# EAGLE design BeerTape_Hardware (EAGLE 9.6.2)
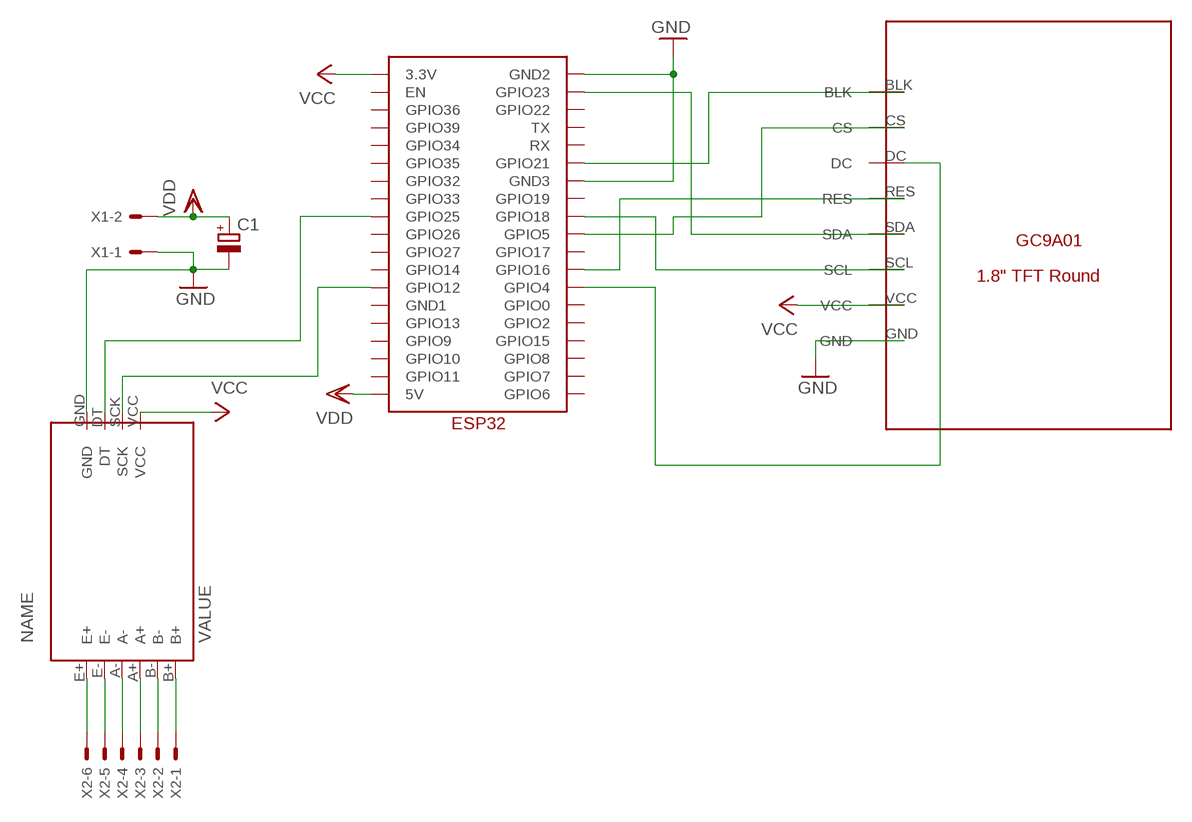
[diagram p0: schematic, sheet 1]

## Parts
C1  CPOL-EUE2,5-6E  [E2,5-6E]
HX711  HX711  HX711A  [HX711]
U$1  GC9A01  [GC9A01]
U$2  ESP32  [ESP32]
X1  KK-156-2  [KK-156-2]
X2  22-23-2061  [22-23-2061]

## Nets
GND [PWR]: C1.- HX711.GND U$1.GND U$2.GND2 U$2.GND3 X1.1
N$1: U$1.DC U$2.GPIO4
N$2: U$1.SDA U$2.GPIO23
N$3: U$1.BLK U$2.GPIO21
N$4: U$1.SCL U$2.GPIO18
N$5: U$1.RES U$2.GPIO16
N$6: U$1.CS U$2.GPIO5
N$7: HX711.SCK U$2.GPIO12
N$8: HX711.DT U$2.GPIO25
N$15: HX711.E+ X2.6
N$16: HX711.E- X2.5
N$17: HX711.A- X2.4
N$18: HX711.A+ X2.3
N$19: HX711.B- X2.2
N$20: HX711.B+ X2.1
VCC [PWR]: HX711.VCC U$1.VCC U$2.3.3V
VDD [PWR]: C1.+ U$2.5V X1.2
Unconnected: U$2.EN U$2.GND1 U$2.GPIO0 U$2.GPIO2 U$2.GPIO6 U$2.GPIO7 U$2.GPIO8 U$2.GPIO9 U$2.GPIO10 U$2.GPIO11 U$2.GPIO13 U$2.GPIO14 U$2.GPIO15 U$2.GPIO17 U$2.GPIO19 U$2.GPIO22 U$2.GPIO26 U$2.GPIO27 U$2.GPIO32 U$2.GPIO33 U$2.GPIO34 U$2.GPIO35 U$2.GPIO36 U$2.GPIO39 U$2.RX U$2.TX

## Library data of the parts
C1 = rcl:CPOL-EU: POLARIZED CAPACITOR, European symbol; SPICEPREFIX: C
HX711 = HX711:HX711
U$1 = GC9A01:GC9A01
U$2 = ESP32:ESP32
X1 = con-molex:KK-156-2: KK 156 HEADER Source: http://www.molex.com/pdm_docs/sd/026604100_sd.pdf; MF: MOLEX; OC_FARNELL: unknown; OC_NEWARK: unknown
X2 = con-molex:22-23-2061: .100" (2.54mm) Center Header - 6 Pin; MF: MOLEX; MPN: 22-23-2061; OC_FARNELL: 1462922; OC_NEWARK: 27C1933

## Net classes
0 default: width 0.508 mm, clearance 0.381 mm
1 PWR: width 0.635 mm, clearance 0.381 mm

## Board
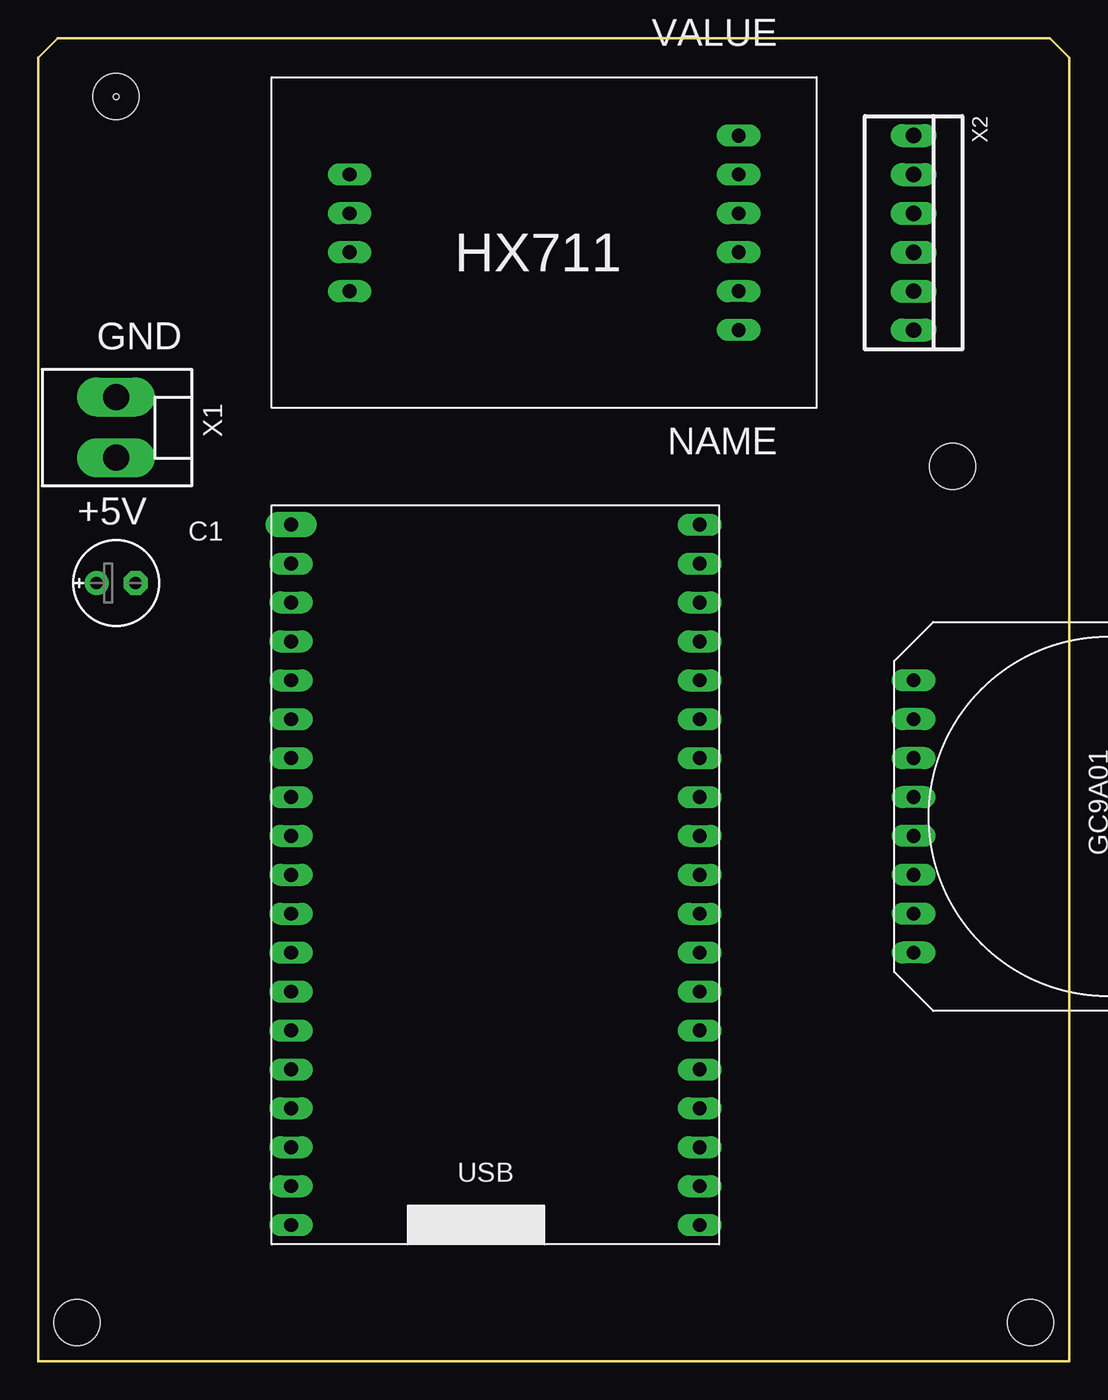
[diagram p1: board, top side]
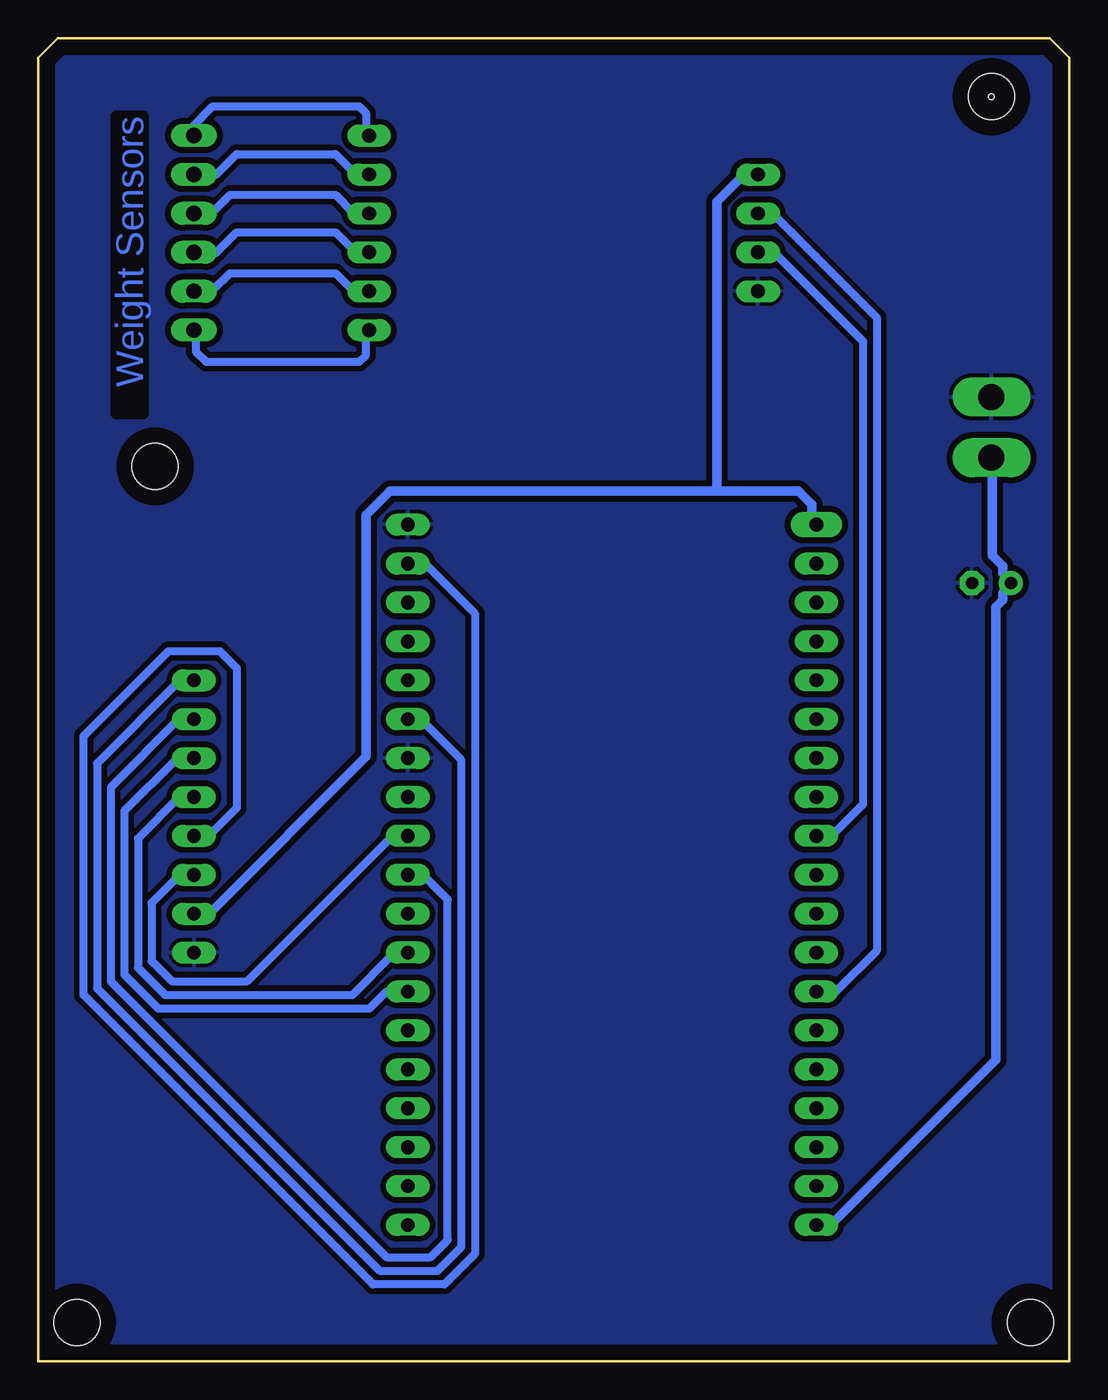
[diagram p2: board, bottom side, seen from below]

Size 67.31 x 86.36 mm. Coordinates in mm from the lower left corner, seen from the top.
Outline: 1.27,86.36 66.04,86.36 67.31,85.09 67.31,0 0,0 0,85.09 1.27,86.36
Copper layers (1*16): Top 0.035mm / dielectric 1.5mm / Bottom 0.035mm
Design rules "default": minimum track width 6mil, minimum drill 0.35mm, track to track 6mil, track to pad 6mil, pad to pad 6mil, via to via 6mil, smd to smd 6mil, copper to edge 40mil, drill to drill 6mil, minimum pad ring 10mil, minimum via ring 8mil, stop-mask expansion 4mil, vias tented up to drill 0mil, thermal gap 10mil
Holes 0.35 mm at 5.08,82.55
Holes 3 mm at 5.08,82.55 2.54,2.54 64.77,2.54 59.69,58.42

### Footprints (pad centres in the part's own frame; a part is rotated, then mirrored left to right if it is on the bottom)
E2,5-6E = drill 0.813 pad 1.575: + -1.27,0 | drill 0.813 pad 1.575 octagon: - 1.27,0
HX711 = drill 0.9 pad 1.422 long: A+ 8.89,21.59; A- 8.89,24.13; B+ 8.89,16.51; B- 8.89,19.05; DT 34.29,24.13; E+ 8.89,29.21; E- 8.89,26.67; GND 34.29,26.67; SCK 34.29,21.59; VCC 34.29,19.05
GC9A01 = drill 0.9 pad 1.422 long: BLK 17.78,0; CS 15.24,0; DC 12.7,0; GND 0,0; RES 10.16,0; SCL 5.08,0; SDA 7.62,0; VCC 2.54,0
ESP32 = drill 0.9 pad 1.676 long: 3.3V 1.27,46.99 | drill 0.9 pad 1.422 long: 5V 1.27,1.27; EN 1.27,44.45; GND1 1.27,13.97; GND2 27.94,46.99; GND3 27.94,31.75; GPIO0 27.94,13.97; GPIO2 27.94,11.43; GPIO4 27.94,16.51; GPIO5 27.94,24.13; GPIO6 27.94,1.27; GPIO7 27.94,3.81; GPIO8 27.94,6.35; GPIO9 1.27,8.89; GPIO10 1.27,6.35; GPIO11 1.27,3.81; GPIO12 1.27,16.51; GPIO13 1.27,11.43; GPIO14 1.27,19.05; GPIO15 27.94,8.89; GPIO16 27.94,19.05; GPIO17 27.94,21.59; GPIO18 27.94,26.67; GPIO19 27.94,29.21; GPIO21 27.94,34.29; GPIO22 27.94,41.91; GPIO23 27.94,44.45; GPIO25 1.27,26.67; GPIO26 1.27,24.13; GPIO27 1.27,21.59; GPIO32 1.27,31.75; GPIO33 1.27,29.21; GPIO34 1.27,36.83; GPIO35 1.27,34.29; GPIO36 1.27,41.91; GPIO39 1.27,39.37; RX 27.94,36.83; TX 27.94,39.37
KK-156-2 = drill 1.7 pad 2.184 long: 1 -1.98,0; 2 1.98,0
22-23-2061 = drill 1 long: 1 -6.35,0; 2 -3.81,0; 3 -1.27,0; 4 1.27,0; 5 3.81,0; 6 6.35,0

### Placement (x,y rotation side)
C1  5.08,50.8 0 top
HX711  54.61,96.52 180 top
U$1  57.15,26.67 90 top
U$2  15.24,7.62 0 top
X1  5.08,60.96 270 top
X2  57.15,73.66 270 top

### Tracks (layer width: path | path; a pad name or v marks a point on that pad's centre or on a via)
GND
  pour Bottom: 0,86.36 67.31,86.36 67.31,0 0,0
N$1
  Bottom 0.508: U$2.GPIO4 44.58,24.13 45.69,23.02 59.47,23.02 61.69,25.24 61.69,35.91 58.36,39.24 57.25,39.24 U$1.DC
N$2
  Bottom 0.508: U$1.SDA 57.02,34.35 56.13,34.35 54.36,36.13 54.36,45.24 55.47,46.36 58.8,46.36 64.36,40.8 64.36,23.91 45.47,5.02 40.8,5.02 38.8,7.02 38.8,48.8 41.91,51.91 43.02,51.91 U$2.GPIO23
N$3
  Bottom 0.508: U$2.GPIO21 42.35,41.91 39.69,39.24 39.69,7.46 41.24,5.91 45.02,5.91 63.47,24.35 63.47,39.02 58.13,44.36 57.25,44.36 U$1.BLK
N$4
  Bottom 0.508: U$2.GPIO18 43.24,34.13 44.36,34.13 53.69,24.8 58.58,24.8 59.91,26.13 59.91,29.91 58.13,31.69 57.25,31.69 U$1.SCL
N$5
  Bottom 0.508: U$2.GPIO16 43.24,26.57 44.13,26.57 46.8,23.91 59.02,23.91 60.8,25.69 60.8,34.13 58.13,36.8 57.25,36.8 U$1.RES
N$6
  Bottom 0.508: U$1.CS 58.13,41.91 62.58,37.47 62.58,24.8 44.58,6.79 41.69,6.79 40.58,7.91 40.58,30.13 42.13,31.69 43.02,31.69 U$2.GPIO5
N$7
  Bottom 0.508: U$2.GPIO12 15.24,24.13 12.57,26.8 12.57,68.14 19.24,74.8 20.13,74.8 HX711.SCK
N$8
  Bottom 0.508: U$2.GPIO25 16.35,34.35 15.46,34.35 13.46,36.35 13.46,66.58 19.24,72.36 20.13,72.36 HX711.DT
N$15
  Bottom 0.508: HX711.E+ 45.91,67.25 45.91,65.69 46.36,65.25 56.36,65.25 57.02,65.91 57.02,67.25 X2.6
N$16
  Bottom 0.508: HX711.E- 45.91,69.91 46.8,69.91 47.91,71.03 54.8,71.03 55.91,69.91 57.02,69.91 X2.5
N$17
  Bottom 0.508: HX711.A- 45.91,72.58 46.8,72.58 47.91,73.69 54.36,73.69 55.69,72.36 57.02,72.36 X2.4
N$18
  Bottom 0.508: HX711.A+ 45.91,75.03 46.8,75.03 47.91,76.14 54.8,76.14 55.91,75.03 57.02,75.03 X2.3
N$19
  Bottom 0.508: HX711.B- 46.58,77.47 47.91,78.8 54.36,78.8 55.69,77.47 X2.2
N$20
  Bottom 0.508: HX711.B+ 45.91,80.14 45.91,81.47 46.36,81.91 55.91,81.91 57.25,80.58 57.25,80.14 X2.1
VCC
  Bottom 0.635: 23.02,56.8 17.68,56.8 16.8,55.91 16.8,55.02 16.57,54.8 U$2.3.3V | 23.02,56.8 44.36,56.8 45.91,55.24 45.91,39.47 56.13,29.24 57.02,29.24 U$1.VCC | HX711.VCC 21.24,77.47 23.02,75.69 23.02,56.8
VDD
  Bottom 0.635: U$2.5V 16.35,9.02 15.46,9.02 4.79,19.68 4.79,49.24 4.35,49.69 4.35,50.13 3.68,50.8 C1.+ 4.13,50.8 4.13,51.24 4.35,51.47 4.35,51.91 5.02,52.58 5.02,58.8 X1.2

### Text on the board
Bottom: Weight Sensors
tNames: GND | +5V